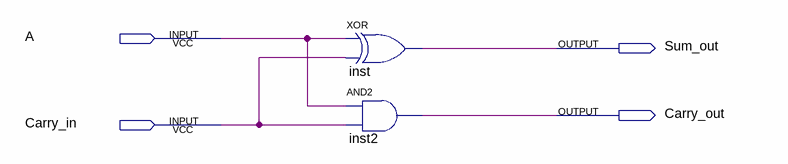
[diagram p0: schematic sheet]
// Quartus schematic Half_Adder.bdf as structural Verilog: 2 symbols, 4 pins
module Half_Adder (
  input  A,
  input  Carry_in,
  output Sum_out,
  output Carry_out
);

  xor inst (Sum_out, A, Carry_in);
  and inst2 (Carry_out, A, Carry_in);
endmodule
